# EAGLE schematic LM2825_schematic (EAGLE 6.6.0)
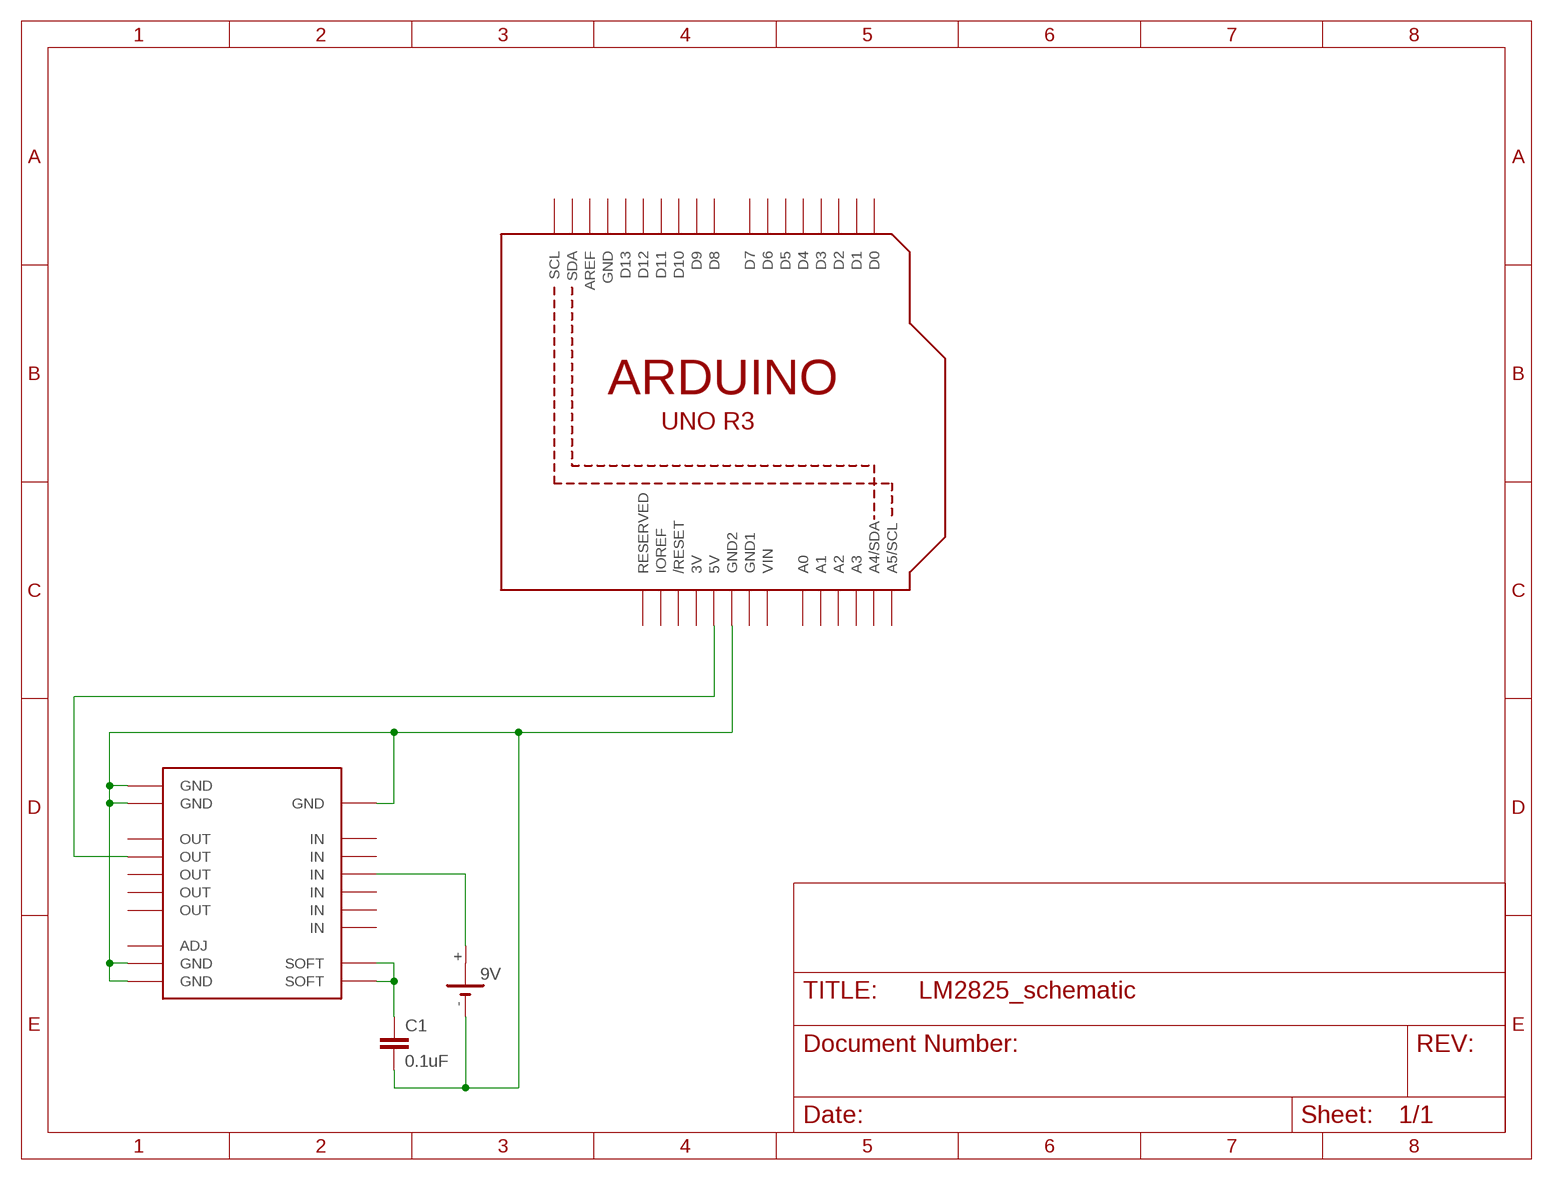
[diagram p0: schematic, sheet 1]

## Parts
9V  1V60R  [1V60R]
C1  0.1uF  CXXC10B5  [XC10B5]
U1  ARDUINOR3-DIMENSION  [ARDUINOR3]
U$5  TI_LM2825  [TI_LM2825_HEADERS]

## Nets
N$1: 9V.+ U$5.IN@19(IN)
N$15: C1.1 U$5.SOFT@13(SOFT) U$5.SOFT@14(SOFT)
N$16: 9V.- C1.2 U1.GND2 U$5.GND@1(GND) U$5.GND@2(GND) U$5.GND@11(GND) U$5.GND@12(GND) U$5.GND@23(GND)
VDD: U1.5V U$5.OUT@5(OUT)
Unconnected: 9V.+@1(+) U1.A0 U1.A1 U1.A2 U1.A3 U1.A4(A4/SDA) U1.A5(A5/SCL) U1.AREF U1.D0 U1.D1 U1.D2 U1.D3 U1.D4 U1.D5 U1.D6 U1.D7 U1.D8 U1.D9 U1.D10 U1.D11 U1.D12 U1.D13 U1.IOREF U1.RESERVED U1.RESET(/RESET) U1.SCL U1.SDA U$5.ADJ U$5.IN@16(IN) U$5.IN@17(IN) U$5.IN@18(IN) U$5.IN@20(IN) U$5.IN@21(IN) U$5.OUT@4(OUT) U$5.OUT@6(OUT) U$5.OUT@7(OUT) U$5.OUT@8(OUT)

## Power pins joined to a net without a drawn wire
3V: U1.3V
GND: U1.GND
GND1: U1.GND1
VIN: U1.VIN

## Library data of the parts
9V = battery:1V60R: NC ACCU Varta
C1 = rcl:CX: X CAPACITOR for power line
U1 = adafruit:ARDUINOR3: This is a new object for the new Arduino R3 - with extra pins that you may want to use (such as IOref, and duplicated A4/A5
U$5 = BLE_sensor_pack_parts:TI_LM2825